# Altium schematic sheet radio_bme.SchDoc
size A4
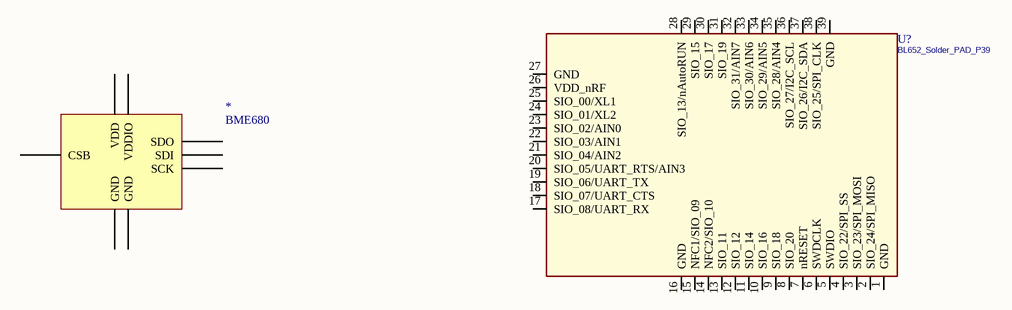
[diagram p0: radio_bme.SchDoc]

## Parts
*  BME680  [BME680]
U?  BL652_Solder_PAD_P39  [XCVR_BL652-SA-01]

## Nets

Not connected (* = marked no-connect by the designer): * 1(GND) 2(CSB) 3(SDI) 4(SCK) 5(SDO) 6(VDDIO) 7(GND) 8(VDD); U? 1(GND) 2(SIO_24/SPI_MISO) 3(SIO_23/SPI_MOSI) 4(SIO_22/SPI_SS) 5(SWDIO) 6(SWDCLK) 7(nRESET) 8(SIO_20) 9(SIO_18) 10(SIO_16) 11(SIO_14) 12(SIO_12) 13(SIO_11) 14(NFC2/SIO_10) 15(NFC1/SIO_09) 16(GND) 17(SIO_08/UART_RX) 18(SIO_07/UART_CTS) 19(SIO_06/UART_TX) 20(SIO_05/UART_RTS/AIN3) 21(SIO_04/AIN2) 22(SIO_03/AIN1) 23(SIO_02/AIN0) 24(SIO_01/XL2) 25(SIO_00/XL1) 26(VDD_nRF) 27(GND) 28(SIO_13/nAutoRUN) 29(SIO_15) 30(SIO_17) 31(SIO_19) 32(SIO_31/AIN7) 33(SIO_30/AIN6) 34(SIO_29/AIN5) 35(SIO_28/AIN4) 36(SIO_27/I2C_SCL) 37(SIO_26/I2C_SDA) 38(SIO_25/SPI_CLK) 39(GND)

## Library data of the parts
U? = BL652_Solder_PAD_P39: BL652 Solder PAD; E Number: ?